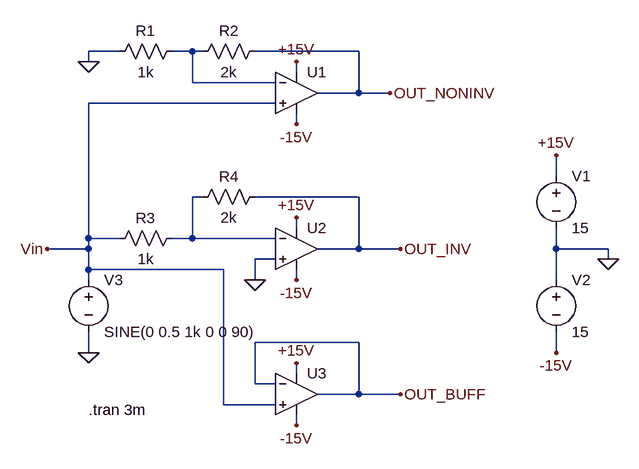
[diagram p0: schematic OperationAmplifiers.asc]
OperationAmplifiers.asc, the LTspice schematic file:
Version 4
SHEET 1 880 680
WIRE -80 -96 -128 -96
WIRE 32 -96 0 -96
WIRE 48 -96 32 -96
WIRE 288 -96 128 -96
WIRE -128 -80 -128 -96
WIRE 192 -64 192 -80
WIRE 32 -48 32 -96
WIRE 160 -48 32 -48
WIRE 288 -32 288 -96
WIRE 288 -32 224 -32
WIRE 336 -32 288 -32
WIRE 160 -16 -128 -16
WIRE 192 16 192 0
WIRE 592 96 592 64
WIRE 48 128 32 128
WIRE 288 128 128 128
WIRE 192 176 192 160
WIRE -128 192 -128 -16
WIRE -80 192 -128 192
WIRE 32 192 32 128
WIRE 32 192 0 192
WIRE 160 192 32 192
WIRE -128 208 -128 192
WIRE -128 208 -192 208
WIRE 288 208 288 128
WIRE 288 208 224 208
WIRE 352 208 288 208
WIRE 592 208 592 176
WIRE 672 208 592 208
WIRE 160 224 128 224
WIRE 672 224 672 208
WIRE -128 240 -128 208
WIRE 80 240 -128 240
WIRE -128 256 -128 240
WIRE 128 256 128 224
WIRE 192 256 192 240
WIRE 592 256 592 208
WIRE 288 352 128 352
WIRE -128 368 -128 336
WIRE 592 368 592 336
WIRE 192 400 192 384
WIRE 128 416 128 352
WIRE 160 416 128 416
WIRE 288 432 288 352
WIRE 288 432 224 432
WIRE 352 432 288 432
WIRE 80 448 80 240
WIRE 160 448 80 448
WIRE 192 480 192 464
FLAG 592 64 +15V
FLAG 192 -80 +15V
FLAG 192 160 +15V
FLAG 192 384 +15V
FLAG 592 368 -15V
FLAG 192 480 -15V
FLAG 192 256 -15V
FLAG 192 16 -15V
FLAG 672 224 0
FLAG -128 368 0
FLAG -128 -80 0
FLAG 336 -32 OUT_NONINV
FLAG 352 208 OUT_INV
FLAG 352 432 OUT_BUFF
FLAG -192 208 Vin
FLAG 128 256 0
SYMBOL OpAmps\\UniversalOpAmp2 192 -32 R0
SYMATTR InstName U1
SYMBOL OpAmps\\UniversalOpAmp2 192 208 R0
SYMATTR InstName U2
SYMBOL OpAmps\\UniversalOpAmp2 192 432 R0
SYMATTR InstName U3
SYMBOL voltage 592 80 R0
WINDOW 123 0 0 Left 0
WINDOW 39 0 0 Left 0
SYMATTR InstName V1
SYMATTR Value 15
SYMBOL voltage 592 240 R0
WINDOW 123 0 0 Left 0
WINDOW 39 0 0 Left 0
SYMATTR InstName V2
SYMATTR Value 15
SYMBOL voltage -128 240 R0
WINDOW 123 0 0 Left 0
WINDOW 39 0 0 Left 0
SYMATTR InstName V3
SYMATTR Value SINE(0 0.5 1k 0 0 90)
SYMBOL res 16 -112 R90
WINDOW 0 0 56 VBottom 2
WINDOW 3 32 56 VTop 2
SYMATTR InstName R1
SYMATTR Value 1k
SYMBOL res 144 -112 R90
WINDOW 0 0 56 VBottom 2
WINDOW 3 32 56 VTop 2
SYMATTR InstName R2
SYMATTR Value 2k
SYMBOL res 16 176 R90
WINDOW 0 0 56 VBottom 2
WINDOW 3 32 56 VTop 2
SYMATTR InstName R3
SYMATTR Value 1k
SYMBOL res 144 112 R90
WINDOW 0 0 56 VBottom 2
WINDOW 3 32 56 VTop 2
SYMATTR InstName R4
SYMATTR Value 2k
TEXT -128 456 Left 2 !.tran 3m

The netlist it stands for:
* OperationAmplifiers.asc
XU1 Vin N001 +15V -15V OUT_NONINV level2 Avol=1Meg GBW=10Meg Slew=10Meg Ilimit=25m Rail=0 Vos=0 En=0 Enk=0 In=0 Ink=0 Rin=500Meg  ; pins In+ In- V+ V- OUT
XU2 0 N002 +15V -15V OUT_INV level2 Avol=1Meg GBW=10Meg Slew=10Meg Ilimit=25m Rail=0 Vos=0 En=0 Enk=0 In=0 Ink=0 Rin=500Meg  ; pins In+ In- V+ V- OUT
XU3 Vin OUT_BUFF +15V -15V OUT_BUFF level2 Avol=1Meg GBW=10Meg Slew=10Meg Ilimit=25m Rail=0 Vos=0 En=0 Enk=0 In=0 Ink=0 Rin=500Meg  ; pins In+ In- V+ V- OUT
V1 +15V 0 15
V2 0 -15V 15
V3 Vin 0 SINE(0 0.5 1k 0 0 90)
R1 N001 0 1k
R2 OUT_NONINV N001 2k
R3 N002 Vin 1k
R4 OUT_INV N002 2k
.tran 3m
.lib UniversalOpAmp2.lib
.backanno
.end